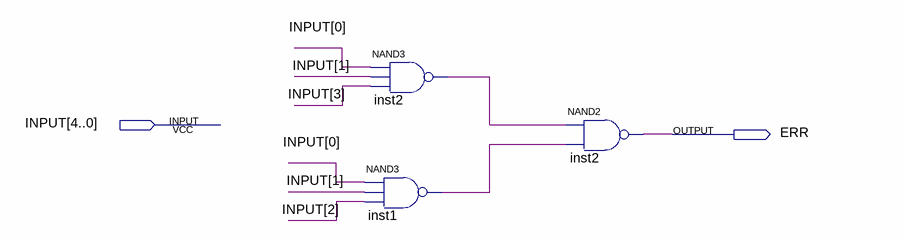
[diagram p0: schematic sheet]
// Quartus schematic g14_error_proc.bdf as structural Verilog: 3 symbols, 2 pins
module g14_error_proc (
  input  [4:0] INPUT,
  output ERR
);

  wire inst1_out, inst2_out;

  nand inst2 (inst2_out, INPUT[0], INPUT[1], INPUT[3]);
  nand inst1 (inst1_out, INPUT[0], INPUT[1], INPUT[2]);
  nand inst2_dup2 (ERR, inst2_out, inst1_out);
endmodule
